# EAGLE design OBC (EAGLE 9.6.2)
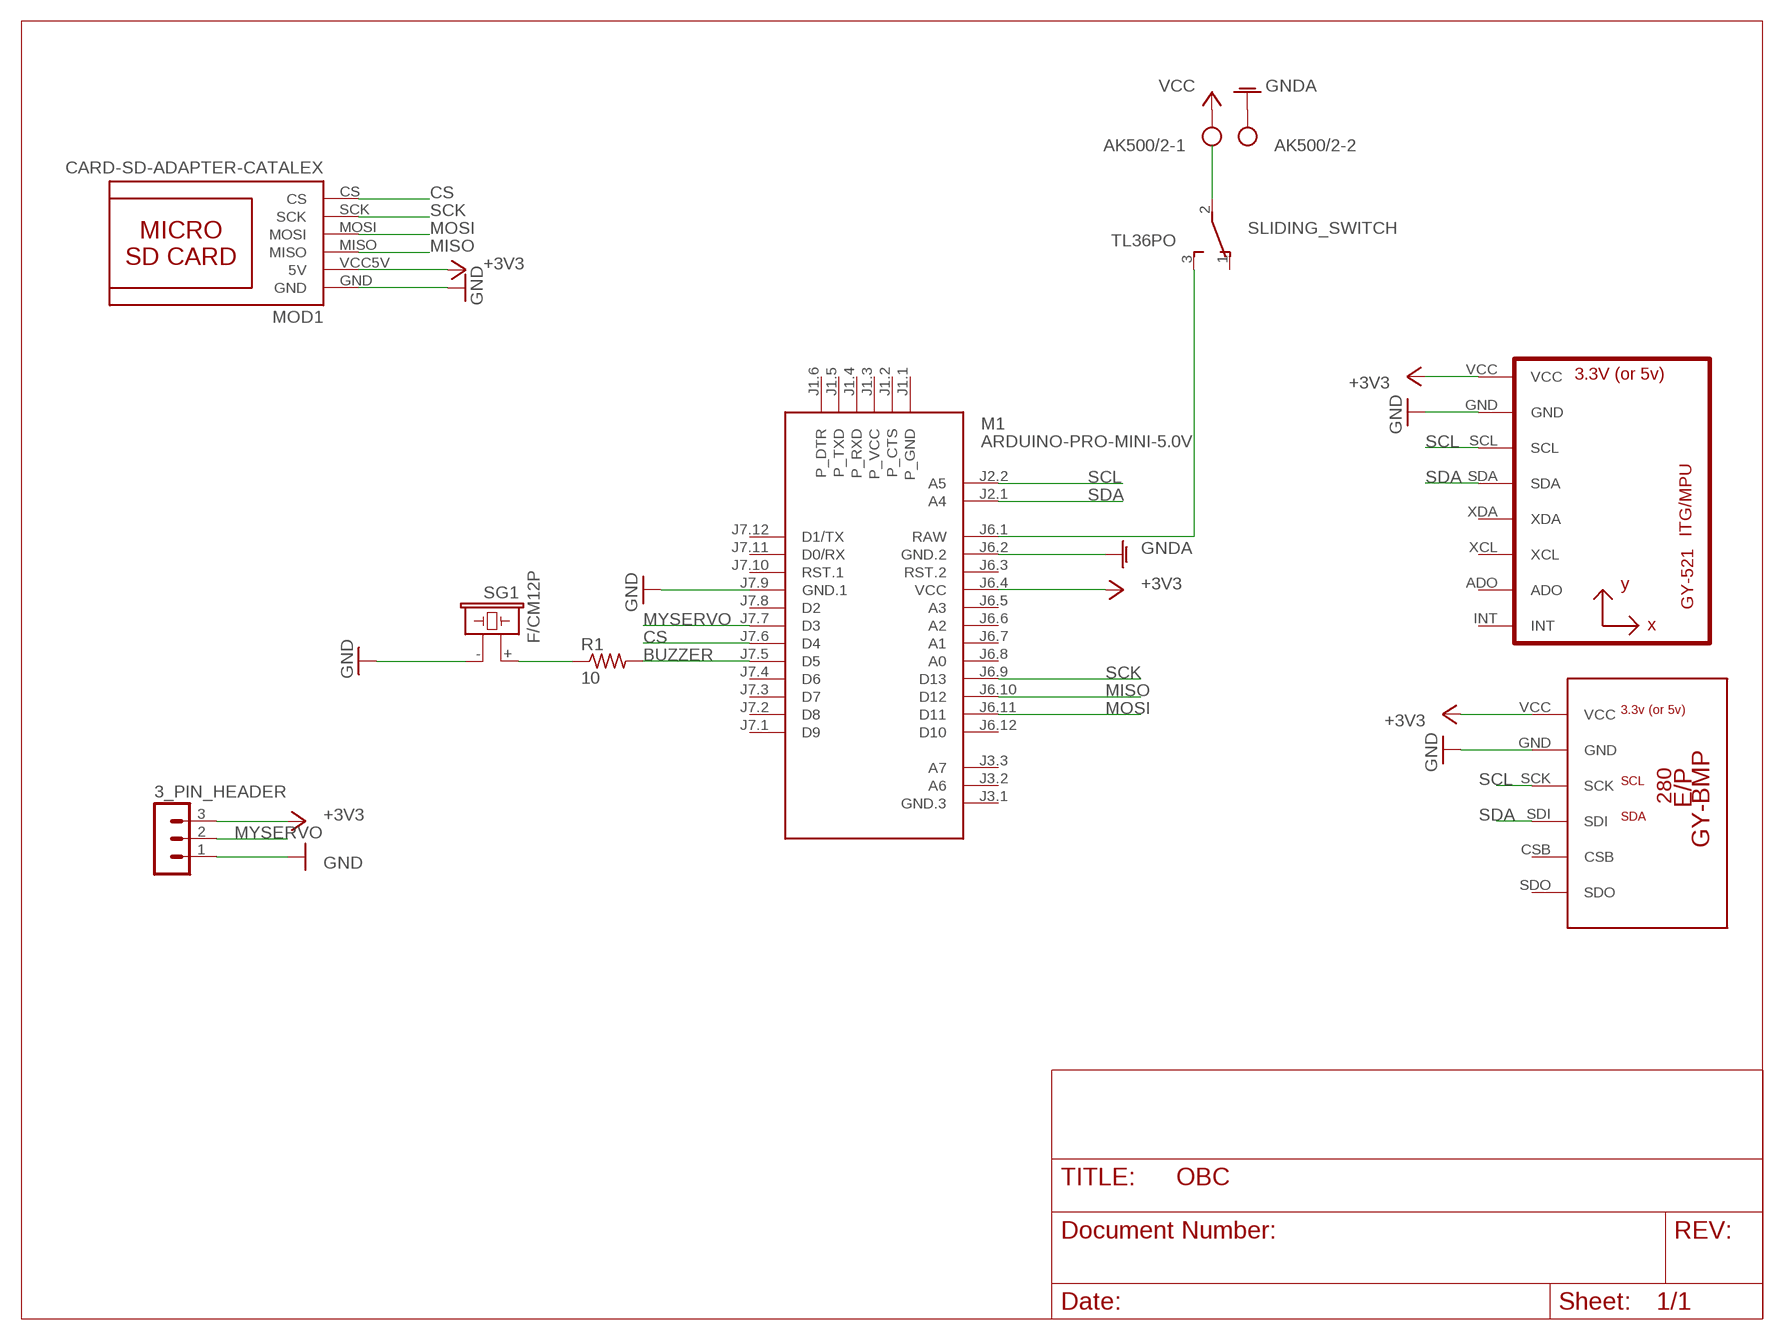
[diagram p0: schematic, sheet 1]

## Parts
3_PIN_HEADER  MA03-1  [MA03-1]
AK500/2  AK500/2  [AK500/2]
M1  ARDUINO-PRO-MINI-5.0V  [ARDUINO-PRO-MINI]
MOD1  CARD-SD-ADAPTER-CATALEX  [CARD-SD-ADAPTER-CATALEX]
R1  10  R-US_0204/7  [0204/7]
SG1  F/CM12P  [F/CM12P]
SLIDING_SWITCH  TL36PO  [TL3XPO]
U1  GY-521MPU6050  [GY-521]
U$1  GY-BPM280  [GY-BMP280-FOOTPRINT]

## Nets
+3V3: 3_PIN_HEADER.3 M1.J6.4(VCC) MOD1.VCC5V(5V) U1.VCC U$1.VCC
BUZZER: M1.J7.5(D5) R1.2
CS: M1.J7.6(D4) MOD1.CS
GND: 3_PIN_HEADER.1 M1.J7.9(GND.1) MOD1.GND SG1.- U1.GND U$1.GND
GNDA: AK500/2.2 M1.J6.2(GND.2)
MISO: M1.J6.10(D12) MOD1.MISO
MOSI: M1.J6.11(D11) MOD1.MOSI
MYSERVO: 3_PIN_HEADER.2 M1.J7.7(D3)
N$1: SLIDING_SWITCH.2(P)
N$2: M1.J6.1(RAW) SLIDING_SWITCH.3(S)
N$3: R1.1 SG1.+
SCK: M1.J6.9(D13) MOD1.SCK
SCL: M1.J2.2(A5) U1.SCL U$1.SCK
SDA: M1.J2.1(A4) U1.SDA U$1.SDI
VCC: AK500/2.1
Unconnected: M1.J1.1(P_GND) M1.J1.2(P_CTS) M1.J1.3(P_VCC) M1.J1.4(P_RXD) M1.J1.5(P_TXD) M1.J1.6(P_DTR) M1.J3.1(GND.3) M1.J3.2(A6) M1.J3.3(A7) M1.J6.3(RST.2) M1.J6.5(A3) M1.J6.6(A2) M1.J6.7(A1) M1.J6.8(A0) M1.J6.12(D10) M1.J7.1(D9) M1.J7.2(D8) M1.J7.3(D7) M1.J7.4(D6) M1.J7.8(D2) M1.J7.10(RST.1) M1.J7.11(D0/RX) M1.J7.12(D1/TX) SLIDING_SWITCH.1(O) U1.ADO U1.INT U1.XCL U1.XDA U$1.CSB U$1.SDO

## Library data of the parts
3_PIN_HEADER = con-lstb:MA03-1: PIN HEADER; OC_FARNELL: unknown; OC_NEWARK: unknown
AK500/2 = con-ptr500:AK500/2: CONNECTOR; OC_FARNELL: unknown; OC_NEWARK: unknown
M1 = diy-modules:ARDUINO-PRO-MINI-*: Arduino Pro Mini and compatible devices More details available here: https://www.arduino.cc/en/Main/ArduinoBoardProMini Click here to find device on ebay.com <http://www.ebay.com/sch/arduino+pro+mini>
MOD1 = SD-Card-Module_CATALEX:CARD-SD-ADAPTER-CATALEX: Micro SD Card Adapter Module with onboard 3.3V regulator
R1 = rcl:R-US_: RESISTOR, American symbol; SPICEPREFIX: R
SG1 = buzzer:F/CM12P: BUZZER Source: Buerklin; OC_FARNELL: unknown; OC_NEWARK: unknown
SLIDING_SWITCH = switch:TL36PO: TINY SWITCH ON - ON Source: http://www2.produktinfo.conrad.com/datenblaetter/700000-724999/705152-da-01-de-Subminiaturschalter_TL_36YO.pdf
U1 = gy-521:GY-521
U$1 = GY-BMP280:GY-BPM280

## Board
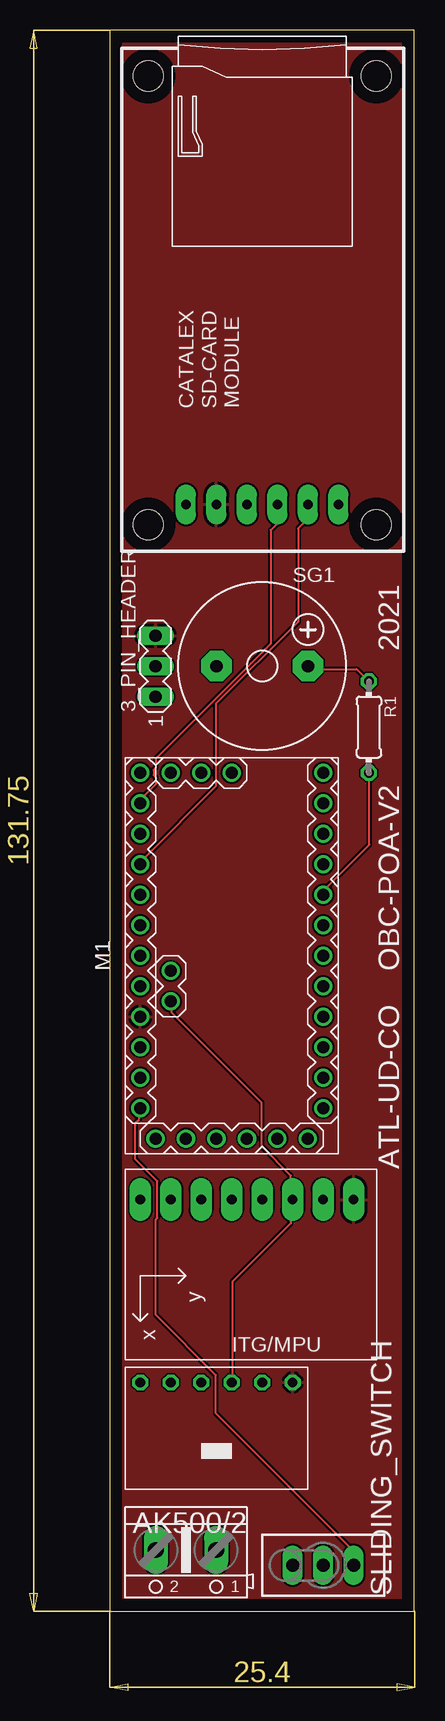
[diagram p1: board, top side]
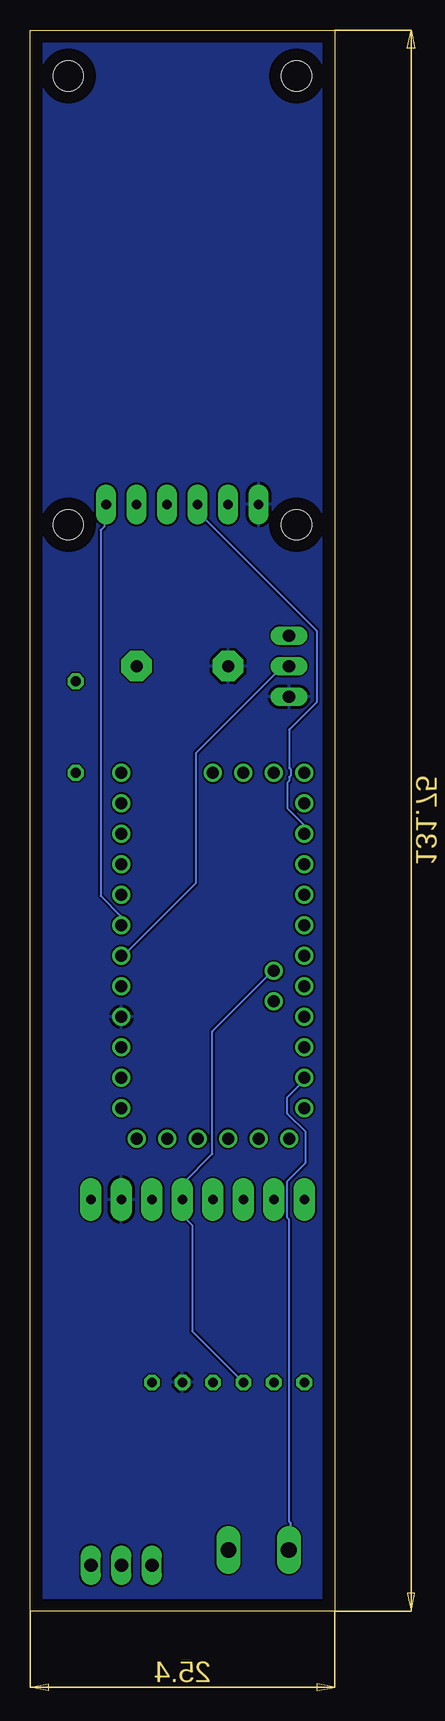
[diagram p2: board, bottom side, seen from below]

Size 25.38 x 131.75 mm. Coordinates in mm from the lower left corner, seen from the top.
Outline: 0,0 25.38,0 25.38,131.75 0,131.75 0,0
Copper layers (1*16): Top 0.035mm / dielectric 1.5mm / Bottom 0.035mm
Design rules "default": minimum track width 6mil, minimum drill 0.35mm, track to track 6mil, track to pad 6mil, pad to pad 6mil, via to via 6mil, smd to smd 6mil, copper to edge 40mil, drill to drill 6mil, minimum pad ring 10mil, minimum via ring 8mil, stop-mask expansion 4mil, vias tented up to drill 0mil, thermal gap 10mil

### Footprints (pad centres in the part's own frame; a part is rotated, then mirrored left to right if it is on the bottom)
MA03-1 = drill 1.016 long: 1 -2.54,0; 2 0,0; 3 2.54,0
AK500/2 = drill 1.321 long: 1 -2.515,0; 2 2.515,0
ARDUINO-PRO-MINI = drill 1: J1.1 -15.24,6.35; J1.2 -15.24,3.81; J1.3 -15.24,1.27; J1.4 -15.24,-1.27; J1.5 -15.24,-3.81; J1.6 -15.24,-6.35; J2.1 -1.27,5.08; J2.2 -3.81,5.08; J3.1 15.24,0; J3.2 15.24,2.54; J3.3 15.24,5.08; J6.1 -12.7,7.62; J6.2 -10.16,7.62; J6.3 -7.62,7.62; J6.4 -5.08,7.62; J6.5 -2.54,7.62; J6.6 0,7.62; J6.7 2.54,7.62; J6.8 5.08,7.62; J6.9 7.62,7.62; J6.10 10.16,7.62; J6.11 12.7,7.62; J6.12 15.24,7.62; J7.1 15.24,-7.62; J7.2 12.7,-7.62; J7.3 10.16,-7.62; J7.4 7.62,-7.62; J7.5 5.08,-7.62; J7.6 2.54,-7.62; J7.7 0,-7.62; J7.8 -2.54,-7.62; J7.9 -5.08,-7.62; J7.10 -7.62,-7.62; J7.11 -10.16,-7.62; J7.12 -12.7,-7.62
CARD-SD-ADAPTER-CATALEX = drill 0.8 pad 1.676 long: CS -17,-6.35; GND -17,6.35; MISO -17,1.27; MOSI -17,-1.27; SCK -17,-3.81; VCC5V -17,3.81 | hole 2.5: -18.7,9.5; 18.7,9.5; 18.7,-9.5; -18.7,-9.5
0204/7 = drill 0.813 octagon: 1 -3.81,0; 2 3.81,0
F/CM12P = drill 1.016 pad 2.54 octagon: + 3.81,0; - -3.81,0
TL3XPO = drill 1.1 pad 1.422 long: 1 -2.54,0; 2 0,0; 3 2.54,0
GY-521 = drill 0.8 pad 1.778 long: ADO -8.89,-6.35; GND -8.89,6.35; INT -8.89,-8.89; SCL -8.89,3.81; SDA -8.89,1.27; VCC -8.89,8.89; XCL -8.89,-3.81; XDA -8.89,-1.27
GY-BMP280-FOOTPRINT = drill 0.8 octagon: CSB 11.43,0; GND 3.81,0; SCK 6.35,0; SDI 8.89,0; SDO 13.97,0; VCC 1.27,0

### Placement (x,y rotation side)
3_PIN_HEADER  3.81,78.74 90 top
AK500/2  6.35,5.08 180 top
M1  10.16,54.61 90 top
MOD1  12.7,109.22 90 top
R1  21.59,73.66 270 top
SG1  12.7,78.74 0 top
SLIDING_SWITCH  17.78,3.81 0 top
U1  11.43,25.4 270 top
U$1  16.51,19.05 180 top

### Tracks (layer width: path | path; a pad name or v marks a point on that pad's centre or on a via)
+3V3
  pour Top: -13.97,135.89 38.1,135.89 38.1,134.62 38.1,-10.16 31.75,-10.16 -13.97,-10.16
BUZZER
  Top 0.152: R1.2 21.64,69.8 21.64,63.86 17.83,60.05 17.83,59.74 M1.J7.5
CS
  Bottom 0.152: M1.J7.6 17.83,57.15 17.83,57.91 19.51,59.59 19.51,90.07 19.2,90.37 19.2,92.05 19.05,92.2 MOD1.CS
GND
  pour Bottom: -17.78,139.7 46.99,139.7 46.99,-12.7 -17.78,-12.7
GNDA
  Bottom 0.152: M1.J6.2 2.59,44.35 2.9,44.04 2.9,43.89 3.96,42.82 3.96,41.45 2.44,39.93 2.44,37.34 3.96,35.81 3.96,32.77 3.81,32.61 3.81,7.47 3.66,7.32 3.66,7.16 3.81,7.01 3.81,5.18 AK500/2.2
MISO
  Bottom 0.152: MOD1.MISO 11.43,91.59 1.52,81.69 1.52,75.74 3.81,73.46 3.81,70.26 3.66,70.1 3.66,69.65 3.81,69.49 3.81,69.19 3.96,69.04 3.96,66.9 2.59,65.53 2.59,64.77 M1.J6.10
MOSI
  Top 0.152: M1.J6.11 2.59,67.36 2.59,67.67 3.81,68.89 3.81,69.49 3.66,69.65 3.66,70.1 3.81,70.26 3.81,71.02 13.41,80.62 13.41,90.07 13.87,90.53 13.87,92.2 MOD1.MOSI
MYSERVO
  Bottom 0.152: M1.J7.7 17.37,55.02 17.22,55.02 11.58,60.66 11.58,71.48 4.42,78.64 3.81,78.64 3_PIN_HEADER.2
N$2
  Top 0.152: M1.J6.1 2.44,41.91 2.44,41 2.13,40.69 2.13,37.64 3.96,35.81 3.96,32.77 3.81,32.61 3.81,24.69 8.84,19.66 8.84,16.46 20.27,5.03 20.27,3.81 SLIDING_SWITCH.3
N$3
  Top 0.152: R1.1 20.57,78.49 16.76,78.49 SG1.+
SCK
  Top 0.152: M1.J6.9 2.59,62.33 2.9,62.64 2.9,62.79 8.84,68.73 8.84,75.59 15.7,82.45 15.7,90.22 16.46,90.98 16.46,92.2 MOD1.SCK
SCL
  Top 0.152: 15.09,34.14 15.09,32.31 10.21,27.43 10.21,19.05 U$1.SCK | 15.09,34.14 15.09,36.27 12.65,38.71 12.65,42.37 5.18,49.84 5.18,50.75 M1.J2.2 | 15.09,34.14 U1.SCL
SDA
  Bottom 0.152: U$1.SDI 11.89,23.32 11.89,32.16 12.65,32.92 12.65,34.29 | 12.65,34.29 12.65,35.66 10.21,38.1 10.21,48.31 5.18,53.34 M1.J2.1 | 12.65,34.29 U1.SDA

### Text on the board
tNames: 2021 | OBC-POA-V2 | ATL-UD-CO